# Altium schematic sheet Componentes.SchDoc
size A4
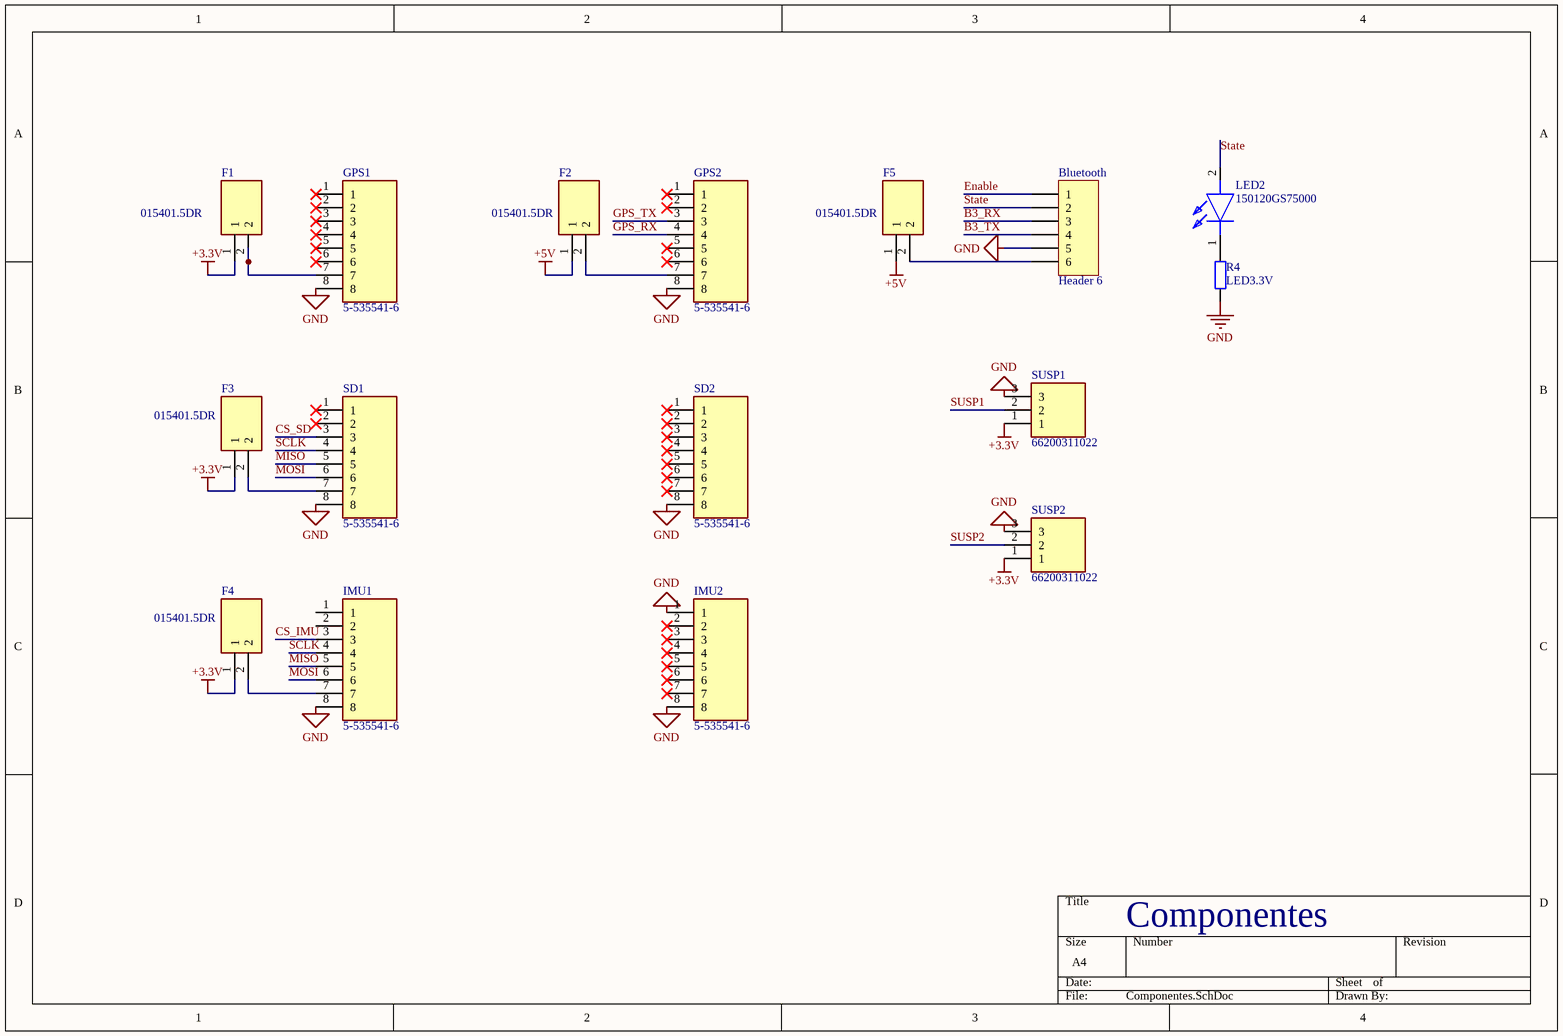
[diagram p0: Componentes.SchDoc]

## Parts
Bluetooth  Header 6  [HDR1X6]
F1  015401.5DR  [Fuse Holder]
F2  015401.5DR  [Fuse Holder]
F3  015401.5DR  [Fuse Holder]
F4  015401.5DR  [Fuse Holder]
F5  015401.5DR  [Fuse Holder]
GPS1  5-535541-6  [RHDR8W60P0X254_1X8_2082X250X850P]
GPS2  5-535541-6  [RHDR8W60P0X254_1X8_2082X250X850P]
IMU1  5-535541-6  [RHDR8W60P0X254_1X8_2082X250X850P]
IMU2  5-535541-6  [RHDR8W60P0X254_1X8_2082X250X850P]
LED2  150120GS75000  [LEDC3214X78N]
R4  LED3.3V  [R 0805]
SD1  5-535541-6  [RHDR8W60P0X254_1X8_2082X250X850P]
SD2  5-535541-6  [RHDR8W60P0X254_1X8_2082X250X850P]
SUSP1  66200311022  [66200311022]
SUSP2  66200311022  [66200311022]

## Nets
+3.3V: F1.1 F3.1 F4.1 SUSP1.1 SUSP2.1
+5V: F2.1 F5.1
GND: Bluetooth.5 GPS1.8 GPS2.8 IMU1.8 IMU2.1 IMU2.8 R4.1 SD1.8 SD2.8 SUSP1.3 SUSP2.3
B3_RX: Bluetooth.3
B3_TX: Bluetooth.4
CS_IMU: IMU1.3
CS_SD: SD1.3
Enable: Bluetooth.1
GPS_RX: GPS2.4
GPS_TX: GPS2.3
MISO: IMU1.5 SD1.5
MOSI: IMU1.6 SD1.6
SCLK: IMU1.4 SD1.4
State: Bluetooth.2 LED2.2(A)
SUSP1: SUSP1.2
SUSP2: SUSP2.2
NetBluetooth_6: Bluetooth.6 F5.2
NetF1_2: F1.2 GPS1.7
NetF2_2: F2.2 GPS2.7
NetF3_2: F3.2 SD1.7
NetF4_2: F4.2 IMU1.7
NetLED2_1: LED2.1(K) R4.2

Not connected (* = marked no-connect by the designer): GPS1 1* 2* 3* 4* 5* 6*; GPS2 1* 2* 5* 6*; IMU1 1 2; IMU2 2* 3* 4* 5* 6* 7*; SD1 1* 2*; SD2 1* 2* 3* 4* 5* 6* 7*

## Notes on the sheet
- Componentes

## Library data of the parts
Bluetooth = Header 6: Header, 6-Pin; LatestRevisionDate: 17-Jul-2002; LatestRevisionNote: Re-released for DXP Platform.; Publisher: Altium Limited
F1-F5 = 015401.5DR: Fuse; Manufacturer_Name: LITTELFUSE; Allied_Number: 70519132; Datasheet Link: https://www.littelfuse.com/~/media/electronics/datasheets/fuses/littelfuse_fuse_154_154t_154l_154tl_datasheet.pdf.pdf; Height: 3.81mm; Manufacturer_Part_Number: 015401.5DR; Mouser Part Number: 576-015401.5DR; Mouser Price/Stock: https://www.mouser.com/Search/Refine.aspx?Keyword=576-015401.5DR; RS Part Number: 7382879P; RS Price/Stock: http://uk.rs-online.com/web/p/products/7382879P; Allied Price/Stock: https://www.alliedelec.com/littelfuse-015401-5dr/70519132/
GPS1 GPS2 IMU1 IMU2 SD1 SD2 = 5-535541-6: Connector Socket Strip RCP 8 POS 2.54mm Solder ST Thru-Hole Gang of Tubes; MF: TE Connectivity; SnapEDA_Link: https://www.snapeda.com/parts/5-535541-6/TE%20Connectivity%20AMP%20Connectors/view-part/497141/?ref=snap; Price: None; Availability: Unavailable; Package: None; Value: *; MP: 5-535541-6
LED2 = 150120GS75000: LED; Manufacturer_Name: Wurth Elektronik; Height: 0.78mm; Manufacturer_Part_Number: 150120GS75000; Mouser Part Number: 710-150120GS75000; Mouser Price/Stock: https://www.mouser.co.uk/ProductDetail/Wurth-Elektronik/150120GS75000?qs=LlUlMxKIyB3I3AMxrmBw4A%3D%3D
R4 = 560050320011_2: WRIS-KSKE SMT Thick Film Resistor, size 0805, 1Ohm, 0.33W; Manufacturer: Wurth Elektronik; Rated Current: 0.57A; Temperature Coefficient of Resistance: +/-100ppm/degC; Technical Reference: KE08051R00F103KAATP0000; Resistance Tolerance: +/-1%; ComponentLink1Description: Manufacturer; ComponentLink1URL: http://www.we-online.de; ComponentLink2Description: Datasheet; ComponentLink2URL: https://www.we-online.com/catalog/datasheet/560050320011.pdf; Published Date: May 2020; Rated Power: 0.33W; Resistance: 1Ohm; Height: 0.6mm; Operating Temperature: -55 to +155degC; Mounting Technology: SMT; Packaging: Tape and Reel; Size: 0805; Length: 2mm; Manufacturer Part Number: 560050320011; Width: 1.25mm
SUSP1 SUSP2 = 66200311022: Connector; Manufacturer_Name: Wurth Elektronik; Datasheet Link: https://docs.rs-online.com/3e1f/A700000007269589.pdf; Height: 5.72mm; Manufacturer_Part_Number: 66200311022; Mouser Part Number: 710-66200311022; Mouser Price/Stock: https://www.mouser.co.uk/ProductDetail/Wurth-Elektronik/66200311022?qs=3RJ0PdSuLVkSi7ZZT4Z8xA%3D%3D